# Altium schematic sheet Arduino_ Connectors.SchDoc: Arduino Uno connector
size A4; Author: P.A.; CompanyName: STMicroelectronics; Organization: Microcontrollers Division; Address1: 12, Rue Jules HOROWITZ; Address2: 38019 Grenoble; Address3: FRANCE; DocumentNumber: MB1261; Revision: B.01; SheetNumber: 4; SheetTotal: 15; Project: STM32L496G-DISCO
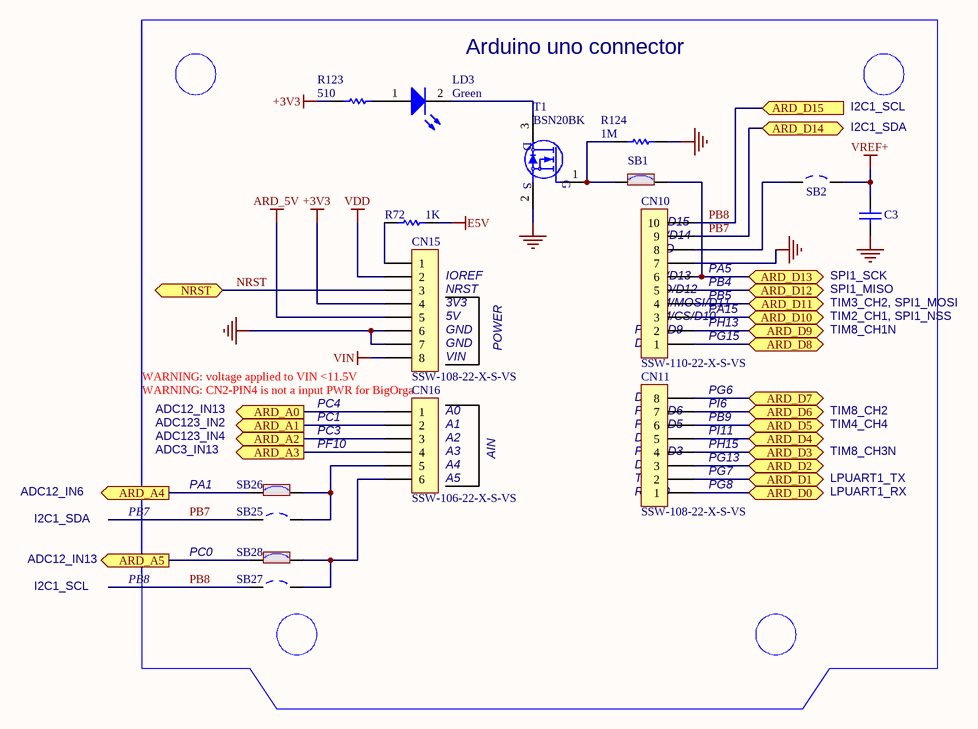
[diagram p0: Arduino_ Connectors.SchDoc]

## Parts
C3  (no value)  [0603C]
CN10  SSW-110-22-X-S-VS  [SSW-110-22-X-S-VS]
CN11  SSW-108-22-X-S-VS  [SSW-108-22-X-S-VS]
CN15  SSW-108-22-X-S-VS  [SSW-108-22-X-S-VS]
CN16  SSW-106-22-X-S-VS  [SSW-106-22-X-S-VS]
LD3  Corlor: Green  [0603D]  (hidden comment: 19-213SY6C/S530-E2/TR8LED)
R72  1K  [0603R]
R123  value 510  [0603R]  (hidden comment: RC0603JR-07510RL)
R124  1M  [0603R]
SB1  Solder Bridge ON  [SB_0603]  (value not drawn)
SB2  Solder Bridge OFF  [SB_0603]  (value not drawn)
SB25  Solder Bridge OFF  [SB_0603]  (value not drawn)
SB26  Solder Bridge ON  [SB_0603]  (value not drawn)
SB27  Solder Bridge OFF  [SB_0603]  (value not drawn)
SB28  Solder Bridge ON  [SB_0603]  (value not drawn)
T1  BSN20BK  [SOT-23]

## Ports
ARD_A0 (out), ARD_A1 (out), ARD_A2 (out), ARD_A3 (out), ARD_A4 (out), ARD_A5 (out), ARD_D0 (bidir), ARD_D1 (bidir), ARD_D2 (bidir), ARD_D3 (bidir), ARD_D4 (bidir), ARD_D5 (bidir), ARD_D6 (bidir), ARD_D7 (bidir), ARD_D8 (bidir), ARD_D9 (bidir), ARD_D10 (bidir), ARD_D11 (bidir), ARD_D12 (bidir), ARD_D13 (bidir), ARD_D14 (bidir), ARD_D15 (in), NRST (bidir)

## Nets
+3V3: CN15.4 R123.1
ARD_5V: CN15.5
E5V: R72.1
GND: C3.2 CN10.7 CN15.6 CN15.7 R124.2 T1.2(S)
VDD: CN15.2
VIN: CN15.8
VREF+: C3.1 SB2.2
ARD_A0: CN16.1 ; port ARD_A0
ARD_A1: CN16.2 ; port ARD_A1
ARD_A2: CN16.3 ; port ARD_A2
ARD_A3: CN16.4 ; port ARD_A3
ARD_A4: SB26.1 ; port ARD_A4
ARD_A5: SB28.1 ; port ARD_A5
ARD_D0: CN11.1 ; port ARD_D0
ARD_D1: CN11.2 ; port ARD_D1
ARD_D2: CN11.3 ; port ARD_D2
ARD_D3: CN11.4 ; port ARD_D3
ARD_D4: CN11.5 ; port ARD_D4
ARD_D5: CN11.6 ; port ARD_D5
ARD_D6: CN11.7 ; port ARD_D6
ARD_D7: CN11.8 ; port ARD_D7
ARD_D8: CN10.1 ; port ARD_D8
ARD_D9: CN10.2 ; port ARD_D9
ARD_D10: CN10.3 ; port ARD_D10
ARD_D11: CN10.4 ; port ARD_D11
ARD_D12: CN10.5 ; port ARD_D12
ARD_D13: CN10.6 SB1.2 ; port ARD_D13
NRST: CN15.3 ; port NRST
PB7: CN10.9 SB25.1 ; port ARD_D14
PB8: CN10.10 SB27.1 ; port ARD_D15
NetCN10_8: CN10.8 SB2.1
NetCN15_1: CN15.1 R72.2
NetCN16_5: CN16.5 SB25.2 SB26.2
NetCN16_6: CN16.6 SB27.2 SB28.2
NetLD3_1: LD3.1(A) R123.2
NetLD3_2: LD3.2(K) T1.3(D)
NetR124_1: R124.1 SB1.1 T1.1(G)

## Notes on the sheet
- Arduino uno connector
- I2C1_SCL
- I2C1_SDA
- (near CN10) SDA/D14
- SCL/D15
- (near CN10) AVDD
- IOREF
- (near CN15) NRST
- (near CN15) 3V3
- (near CN10) SCK/D13
- (near CN10) MISO/D12
- (near CN10) PWM/MOSI/D11
- (near CN10) GND
- (near CN10) PA15
- (near CN10) PB5
- (near CN10) PB4
- (near CN10) PA5
- TIM3_CH2, SPI1_MOSI
- SPI1_MISO
- (near C3) SPI1_SCK
- WARNING: voltage applied to VIN <11.5V
- (near CN15) 5V
- (near CN15) GND
- (near CN15) VIN
- POWER
- (near CN10) D8
- (near CN10) PWM/D9
- (near CN10) PWM/CS/D10
- (near CN10) PG15
- (near CN10) PH13
- TIM8_CH1N
- TIM2_CH1, SPI1_NSS
- (near CN16) WARNING: CN2-PIN4 is not a input PWR for BigOrga
- ADC3_IN13
- ADC123_IN4
- ADC123_IN2
- ADC12_IN13
- PC4
- PC1
- PC3
- PF10
- (near CN16) A0
- (near CN16) A1
- (near CN16) A2
- (near CN11) D4
- (near CN11) PWM/D5
- (near CN11) PWM/D6
- (near CN11) D7
- (near CN11) PI11
- (near CN11) PB9
- (near CN11) PI6
- PG6
- (near CN11) PH15
- TIM4_CH4
- TIM8_CH2
- ADC12_IN6
- PB7
- PA1
- (near CN16) A3
- (near CN16) A4
- (near CN16) A5
- AIN
- (near CN11) RX/D0
- (near CN11) TX/D1
- (near CN11) D2
- (near CN11) PWM/D3
- (near CN11) PG7
- (near CN11) PG8
- (near CN11) PG13
- LPUART1_TX
- LPUART1_RX
- TIM8_CH3N
- PB8
- PC0
- Title:
- Project:
- Size:
- Revision:
- Variant:
- -
- Date:
- Reference:
- Sheet:
- of

## Library data of the parts
C3 = Cap: Capacitor,100nF,10%,16V,X7R,0603,YAGEO; Manuf_Part_1: CC0603KRX7R7BB104; Ordered by: Subcon; Published: 8-Jun-2000; Revision: July-2002: Re-released for DXP Platform.; Publisher: Altium Limited; Value: 100nF; Manuf_1: YAGEO
CN10 = Header 10X1_Female: Header, 10-Pin, Single row,female; Manuf_1: SAMTEC; Ordered by: Subcon; ECCN_US/EU: NA; LatestRevisionDate: 17-Jul-2002; LatestRevisionNote: Re-released for DXP Platform.; Publisher: Altium Limited; Manuf_Part_1: SSW-110-22-X-S-VS
CN11 CN15 = Header 8X1_Female: Header, 8-Pin, Single row,female; Manuf_1: SAMTEC; Ordered by: Subcon; ECCN_US/EU: NA; LatestRevisionDate: 17-Jul-2002; LatestRevisionNote: Re-released for DXP Platform.; Publisher: Altium Limited; Manuf_Part_1: SSW-108-22-X-S-VS
CN16 = Header 6X1_Female: Header, 6-Pin, Single row,female; Manuf_1: SAMTEC; Ordered by: Subcon; ECCN_US/EU: NA; LatestRevisionDate: 17-Jul-2002; LatestRevisionNote: Re-released for DXP Platform.; Publisher: Altium Limited; Manuf_Part_1: SSW-106-22-X-S-VS
LD3 = LED2: LED,Green,0603; Manuf_1: Everlight; Ordered by: Subcon; ECCN_US/EU: EAR99/NEC; Published: 8-Jun-2000; Revision: July-2002: Re-released for DXP Platform.; Publisher: Altium Limited; Manuf_Part_1: 19-213SY6C/S530-E2/TR8LED
R72 = res1: Resistor,1K,0603,1%; Manuf_1: YAGEO; Manuf_Part_1: RC0603FR-071KL; Ordered by: Subcon; ECCN_US/EU: NA; Published: 8-Jun-2000; Revision: July-2002: Re-released for DXP Platform.; Publisher: Altium Limited; Value: 1K
R123 = res1: Resistor, 510R , 0603,1%,YAGEO; Ordered by: Subcon; ECCN_US/EU: NA; Published: 8-Jun-2000; Revision: July-2002: Re-released for DXP Platform.; Publisher: Altium Limited; Manuf_1: YAGEO; Manuf_Part_1: RC0603JR-07510RL
R124 = res1: Resistor, 1M , 0603; Ordered by: Subcon; ECCN_US/EU: NA; Published: 8-Jun-2000; Revision: July-2002: Re-released for DXP Platform.; Publisher: Altium Limited; Value: 1M
SB1 SB26 SB28 = SB_ON: Manuf_1: YAGEO; Manuf_Part_1: RC0603JR-070RL; Solder: YES; Ordered By: Subcon; Revision: July-2002: Re-released for DXP Platform.; ECCN_US/EU: N/A
SB2 SB25 SB27 = SB_OFF: Solder: NO; Revision: July-2002: Re-released for DXP Platform.; ECCN_US/EU: N/A
T1 = 2N7000: Manuf_1: NXP; Ordered by: Subcon; Manuf_Part_1: BSN20BK; ECCN_US/EU: N/A